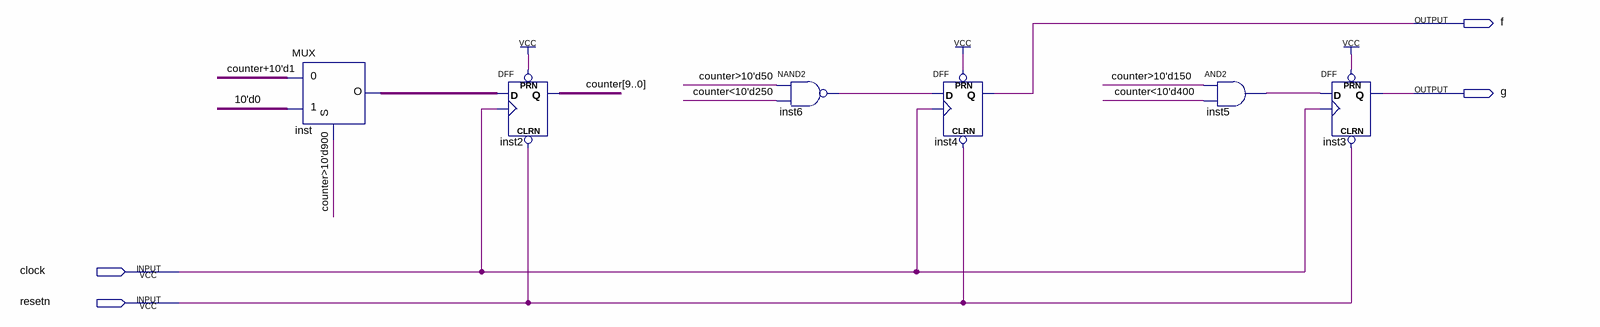
[diagram p0: schematic sheet]
// Quartus schematic Q6.bdf as structural Verilog: 6 symbols, 4 pins
module Q6 (
  input  clock,
  input  resetn,
  output f,
  output g
);

  wire \10'd0 , \counter+10'd1 , \counter<10'd250 , \counter<10'd400 , \counter>10'd50 , \counter>10'd150 ,
       \counter>10'd900 , inst5_out, inst6_out;
  wire [9:0] counter, inst_o;

  MUX inst (.\0 (\counter+10'd1 ), .\1 (\10'd0 ), .S(\counter>10'd900 ), .O(inst_o));
  DFF inst2[9:0] (.CLRN(resetn), .CLK(clock), .D(inst_o), .PRN(1'b1), .Q(counter));
  nand inst6 (inst6_out, \counter>10'd50 , \counter<10'd250 );
  DFF inst4 (.CLRN(resetn), .CLK(clock), .D(inst6_out), .PRN(1'b1), .Q(f));
  and inst5 (inst5_out, \counter>10'd150 , \counter<10'd400 );
  DFF inst3 (.CLRN(resetn), .CLK(clock), .D(inst5_out), .PRN(1'b1), .Q(g));
endmodule
